# EAGLE design ATX_PSU_rev0.1 (EAGLE 9.1.1)
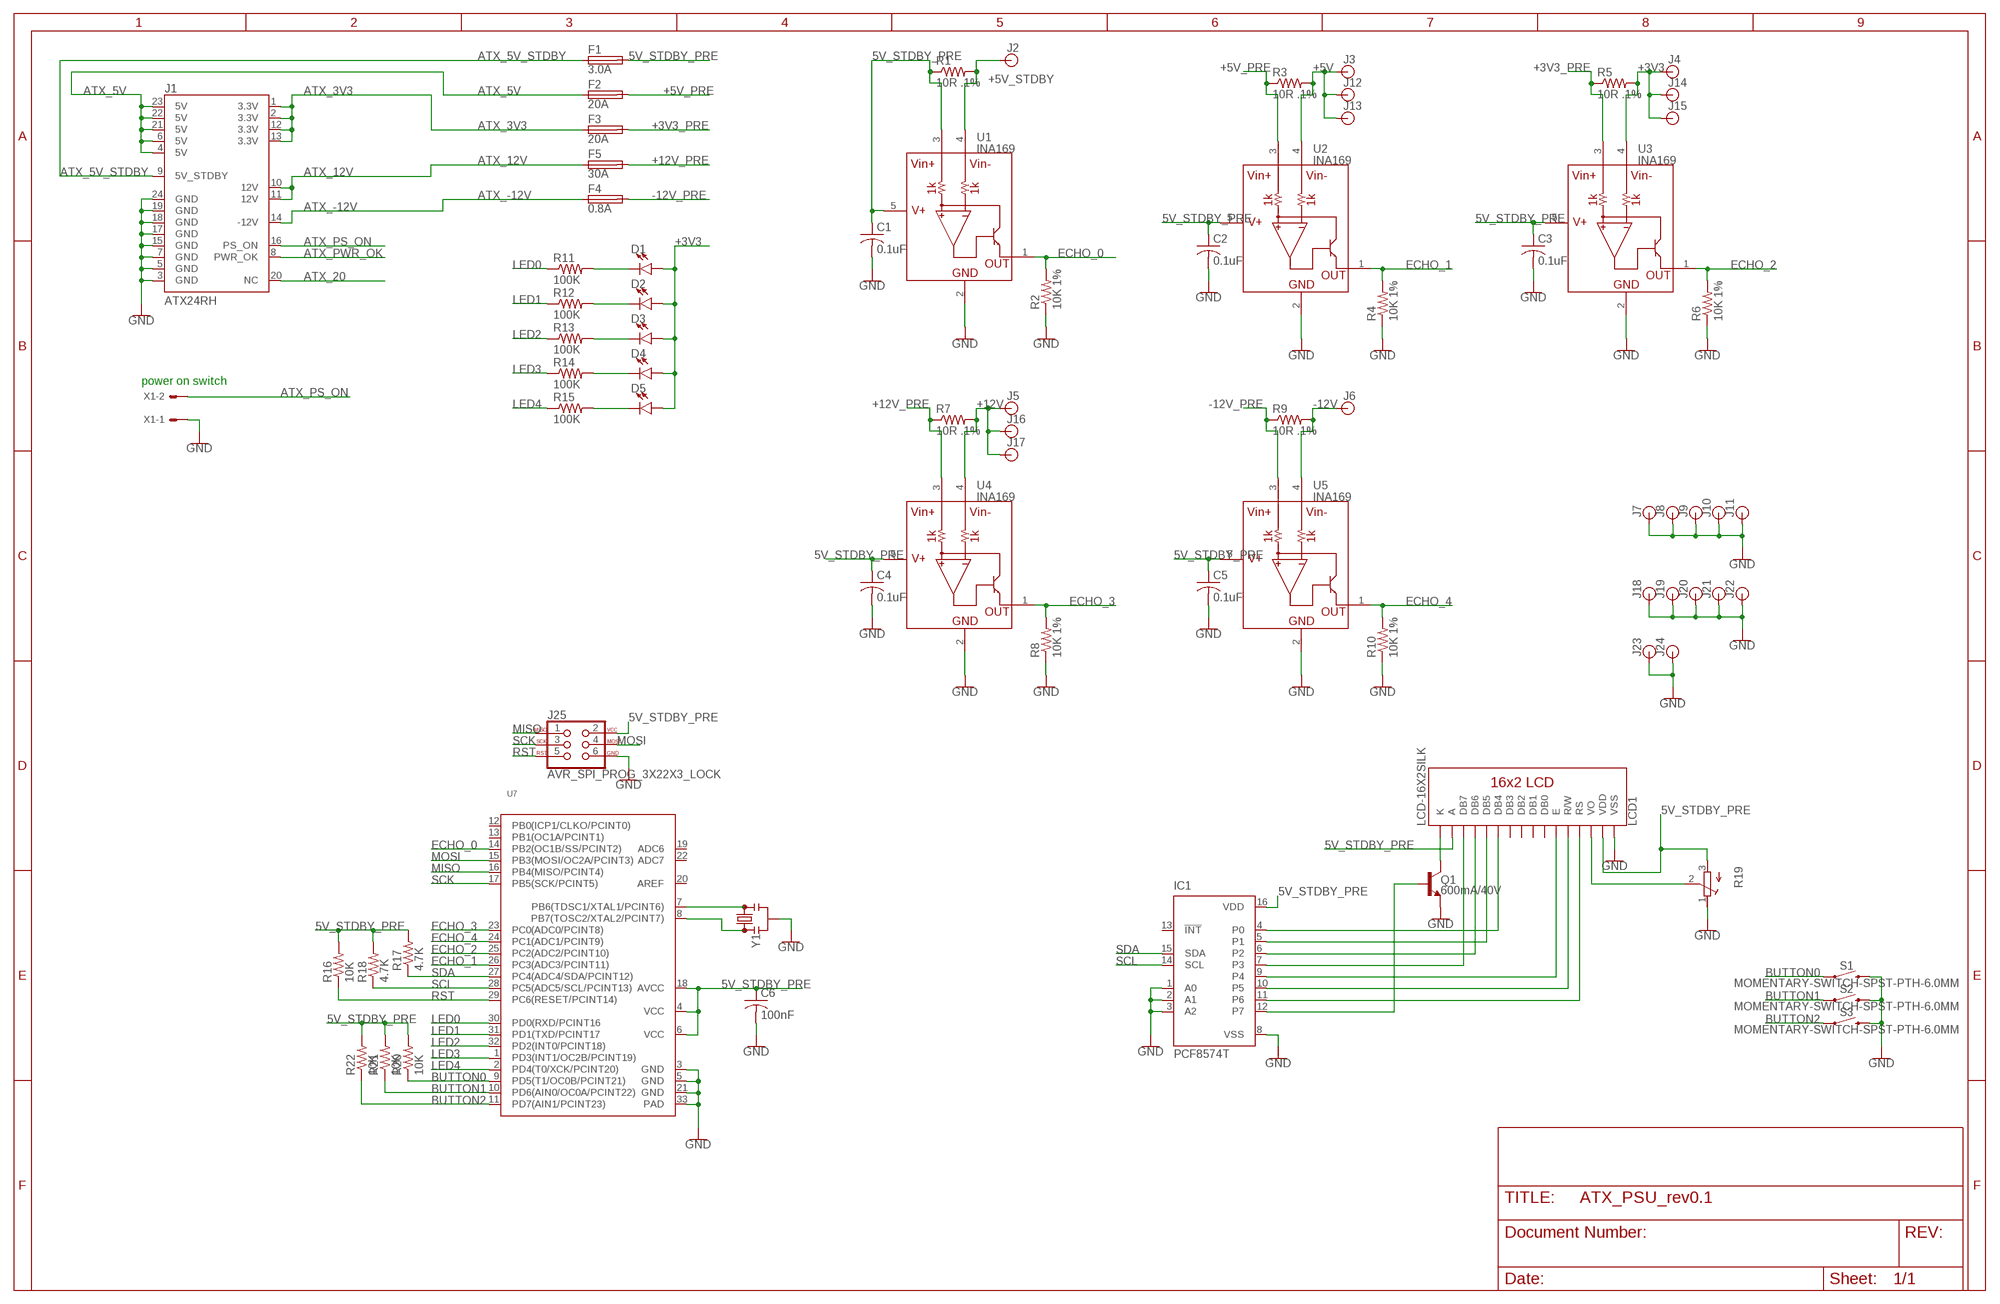
[diagram p0: schematic, sheet 1]

## Parts
C1  0.1uF  C-USC1206  [C1206]
C2  0.1uF  C-USC1206  [C1206]
C3  0.1uF  C-USC1206  [C1206]
C4  0.1uF  C-USC1206  [C1206]
C5  0.1uF  C-USC1206  [C1206]
C6  100nF  C-USC1206  [C1206]
D1  LED-FKIT-1206  [FKIT-LED-1206]
D2  LED-FKIT-1206  [FKIT-LED-1206]
D3  LED-FKIT-1206  [FKIT-LED-1206]
D4  LED-FKIT-1206  [FKIT-LED-1206]
D5  LED-FKIT-1206  [FKIT-LED-1206]
F1  3.0A  FUSEBLANK_5X20MM  [FUSE_HOLDER_5X20MM]
F2  20A  FUSEBLANK_5X20MM  [FUSE_HOLDER_5X20MM]
F3  20A  FUSEBLANK_5X20MM  [FUSE_HOLDER_5X20MM]
F4  0.8A  FUSEBLANK_5X20MM  [FUSE_HOLDER_5X20MM]
F5  30A  FUSEBLANK_5X20MM  [FUSE_HOLDER_5X20MM]
IC1  PCF8574T  [SO16W]
J1  ATX24RH  [ATX24_RIGHT_ANGLE]
J2  BANANA_CONN  [BANANA_CONN]
J3  BANANA_CONN  [BANANA_CONN]
J4  BANANA_CONN  [BANANA_CONN]
J5  BANANA_CONN  [BANANA_CONN]
J6  BANANA_CONN  [BANANA_CONN]
J7  BANANA_CONN  [BANANA_CONN]
J8  BANANA_CONN  [BANANA_CONN]
J9  BANANA_CONN  [BANANA_CONN]
J10  BANANA_CONN  [BANANA_CONN]
J11  BANANA_CONN  [BANANA_CONN]
J12  BANANA_CONN  [BANANA_CONN]
J13  BANANA_CONN  [BANANA_CONN]
J14  BANANA_CONN  [BANANA_CONN]
J15  BANANA_CONN  [BANANA_CONN]
J16  BANANA_CONN  [BANANA_CONN]
J17  BANANA_CONN  [BANANA_CONN]
J18  BANANA_CONN  [BANANA_CONN]
J19  BANANA_CONN  [BANANA_CONN]
J20  BANANA_CONN  [BANANA_CONN]
J21  BANANA_CONN  [BANANA_CONN]
J22  BANANA_CONN  [BANANA_CONN]
J23  BANANA_CONN  [BANANA_CONN]
J24  BANANA_CONN  [BANANA_CONN]
J25  AVR_SPI_PROG_3X22X3_LOCK  [2X3_LOCK]
LCD1  LCD-16X2SILK  [LCD-16X2]
Q1  600mA/40V  TRANS_NPN-MMBT2222AL  [SOT23-3]
R1  10R .1%  R-US_R1206  [R1206]
R2  10K 1%  R-US_R1206  [R1206]
R3  10R .1%  R-US_R1206  [R1206]
R4  10K 1%  R-US_R1206  [R1206]
R5  10R .1%  R-US_R1206  [R1206]
R6  10K 1%  R-US_R1206  [R1206]
R7  10R .1%  R-US_R1206  [R1206]
R8  10K 1%  R-US_R1206  [R1206]
R9  10R .1%  R-US_R1206  [R1206]
R10  10K 1%  R-US_R1206  [R1206]
R11  100K  R-US_R1206  [R1206]
R12  100K  R-US_R1206  [R1206]
R13  100K  R-US_R1206  [R1206]
R14  100K  R-US_R1206  [R1206]
R15  100K  R-US_R1206  [R1206]
R16  10K  R-US_R1206  [R1206]
R17  4.7K  R-US_R1206  [R1206]
R18  4.7K  R-US_R1206  [R1206]
R19  R-TRIMM3314G  [RTRIM3314G]
R20  10K  R-US_R1206  [R1206]
R21  10K  R-US_R1206  [R1206]
R22  10K  R-US_R1206  [R1206]
S1  MOMENTARY-SWITCH-SPST-PTH-6.0MM  [TACTILE_SWITCH_PTH_6.0MM]
S2  MOMENTARY-SWITCH-SPST-PTH-6.0MM  [TACTILE_SWITCH_PTH_6.0MM]
S3  MOMENTARY-SWITCH-SPST-PTH-6.0MM  [TACTILE_SWITCH_PTH_6.0MM]
U1  INA169  [SOT23-5]
U2  INA169  [SOT23-5]
U3  INA169  [SOT23-5]
U4  INA169  [SOT23-5]
U5  INA169  [SOT23-5]
U7  MCU-ATMEGA168PA-MU(QFN32)  [QFN32G-0.5-5X5MM]
X1  KK-156-2  [KK-156-2]
Y1  RESONATORSMD-3.2X1.3  [RESONATOR-SMD-3.2X1.3]

## Nets
5V_STDBY_PRE: C1.1 C2.1 C3.1 C4.1 C5.1 C6.1 F1.2 IC1.16(VDD) J25.2 LCD1.2(VDD) LCD1.15(A) R1.1 R16.2 R17.2 R18.2 R19.3(A) R20.2 R21.2 R22.2 U1.3(VIN+) U1.5(V+) U2.5(V+) U3.5(V+) U4.5(V+) U5.5(V+) U7.4(VCC) U7.6(VCC) U7.18(AVCC)
+3V3: D1.A D2.A D3.A D4.A D5.A J4.P$1 J14.P$1 J15.P$1 R5.2 U3.4(VIN-)
+3V3_PRE: F3.2 R5.1 U3.3(VIN+)
+5V: J3.P$1 J12.P$1 J13.P$1 R3.2 U2.4(VIN-)
+5V_PRE: F2.2 R3.1 U2.3(VIN+)
+5V_STDBY: J2.P$1 R1.2 U1.4(VIN-)
+12V: J5.P$1 J16.P$1 J17.P$1 R7.2 U4.4(VIN-)
+12V_PRE: F5.2 R7.1 U4.3(VIN+)
-12V: J6.P$1 R9.2 U5.4(VIN-)
-12V_PRE: F4.2 R9.1 U5.3(VIN+)
ATX_3V3: F3.1 J1.1(3.3V) J1.2(3.3V) J1.12(3.3V) J1.13(3.3V)
ATX_5V: F2.1 J1.4(5V) J1.6(5V) J1.21(5V) J1.22(5V) J1.23(5V)
ATX_5V_STDBY: F1.1 J1.9(5V_STDBY)
ATX_12V: F5.1 J1.10(12V) J1.11(12V)
ATX_20: J1.20(NC)
ATX_-12V: F4.1 J1.14(-12V)
ATX_PS_ON: J1.16(PS_ON) X1.2
ATX_PWR_OK: J1.8(PWR_OK)
BUTTON0: R20.1 S1.1 U7.9(PD5(T1/OC0B/PCINT21))
BUTTON1: R21.1 S2.1 U7.10(PD6(AIN0/OC0A/PCINT22))
BUTTON2: R22.1 S3.1 U7.11(PD7(AIN1/PCINT23))
ECHO_0: R2.2 U1.1(OUT) U7.14(PB2(OC1B/SS/PCINT2))
ECHO_1: R4.2 U2.1(OUT) U7.26(PC3(ADC3/PCINT11))
ECHO_2: R6.2 U3.1(OUT) U7.25(PC2(ADC2/PCINT10))
ECHO_3: R8.2 U4.1(OUT) U7.23(PC0(ADC0/PCINT8))
ECHO_4: R10.2 U5.1(OUT) U7.24(PC1(ADC1/PCINT9))
GND: C1.2 C2.2 C3.2 C4.2 C5.2 C6.2 IC1.1(A0) IC1.2(A1) IC1.3(A2) IC1.8(VSS) J1.3(GND) J1.5(GND) J1.7(GND) J1.15(GND) J1.17(GND) J1.18(GND) J1.19(GND) J1.24(GND) J7.P$1 J8.P$1 J9.P$1 J10.P$1 J11.P$1 J18.P$1 J19.P$1 J20.P$1 J21.P$1 J22.P$1 J23.P$1 J24.P$1 J25.6 LCD1.1(VSS) Q1.2(E) R2.1 R4.1 R6.1 R8.1 R10.1 R19.1(E) S1.3 S2.3 S3.3 U1.2(GND) U2.2(GND) U3.2(GND) U4.2(GND) U5.2(GND) U7.3(GND) U7.5(GND) U7.21(GND) U7.33(PAD) X1.1 Y1.2
LED0: R11.1 U7.30(PD0(RXD/PCINT16)
LED1: R12.1 U7.31(PD1(TXD/PCINT17)
LED2: R13.1 U7.32(PD2(INT0/PCINT18))
LED3: R14.1 U7.1(PD3(INT1/OC2B/PCINT19))
LED4: R15.1 U7.2(PD4(T0/XCK/PCINT20))
MISO: J25.1 U7.16(PB4(MISO/PCINT4))
MOSI: J25.4 U7.15(PB3(MOSI/OC2A/PCINT3))
N$1: D1.C R11.2
N$2: D2.C R12.2
N$3: IC1.4(P0) LCD1.11(DB4)
N$4: D3.C R13.2
N$5: D4.C R14.2
N$6: D5.C R15.2
N$7: IC1.5(P1) LCD1.12(DB5)
N$8: U7.8(PB7(TOSC2/XTAL2/PCINT7)) Y1.1
N$9: IC1.6(P2) LCD1.13(DB6)
N$10: IC1.7(P3) LCD1.14(DB7)
N$11: U7.7(PB6(TDSC1/XTAL1/PCINT6)) Y1.3
N$12: IC1.9(P4) LCD1.6(E)
N$13: IC1.10(P5) LCD1.5(R/W)
N$14: IC1.11(P6) LCD1.4(RS)
N$15: IC1.12(P7) Q1.1(B)
N$16: LCD1.16(K) Q1.3(C)
N$18: LCD1.3(VO) R19.2(S)
RST: J25.5 R16.1 U7.29(PC6(RESET/PCINT14))
SCK: J25.3 U7.17(PB5(SCK/PCINT5))
SCL: IC1.14(SCL) R18.1 U7.28(PC5(ADC5/SCL/PCINT13))
SDA: IC1.15(SDA) R17.1 U7.27(PC4(ADC4/SDA/PCINT12))
Unconnected: IC1.13(!INT) LCD1.7(DB0) LCD1.8(DB1) LCD1.9(DB2) LCD1.10(DB3) U7.12(PB0(ICP1/CLKO/PCINT0)) U7.13(PB1(OC1A/PCINT1)) U7.19(ADC6) U7.20(AREF) U7.22(ADC7)

## Notes on the sheet
- power on switch

## Library data of the parts
C1-C6 = resistor:C-US: CAPACITOR, American symbol
D1-D5 = SparkFun-LED:LED: LED (Generic) Standard schematic elements and footprints for 5mm, 3mm, 1206, and 0603 sized LEDs. Generic LEDs with no color specified.
F1-F5 = fuse:FUSE: Fuse; OC_FARNELL: unknown; OC_NEWARK: unknown
IC1 = micro-philips:PCF8574: I2C-Bus Remote 8-bit I/O expander http://www.semiconductors.philips.com/acrobat_download/datasheets/PCF8574_4.pdf; MPN: PCF8574T/3,512; OC_FARNELL: 1201255; OC_NEWARK: 70R6870
J1 = SparkFun-Connectors:ATX24: ATX24 Pin Power Supply Connector - Right Angle PTH Mount This is a good connector for connecting a computer power supply to a PCB. It's massive, but provides many amps of power at 5V and 12V. SparkFun Products: SparkFun Benchtop Power Board Kit <https://www.sparkfun.com/products/12867> SparkFun Power Driver Shield Kit <https://www.sparkfun.com/products/10618>; PROD_ID: CONN-09674; SF_ID: PRT-09498
J2-J24 = SparkFun-Connectors:BANANA_CONN: Through-hole Banana Jack Basic PTH connection for banana jack plugs SparkFun Products: Multimeter Kit <https://www.sparkfun.com/products/retired/10956> Banana to Alligator Cable <https://www.sparkfun.com/products/retired/509> Banana to Alligator Coax Cable <https://www.sparkfun.com/products/retired/508> Banana to Banana Cable <https://www.sparkfun.com/products/retired/507> Banana to IC Hook Cables <https://www.sparkfun.com/products/retired/506>
J25 = SparkFun-Connectors:AVR_SPI_PROG_3X2: AVR ISP 6 Pin This is the reduced ISP connector for AVR programming. Common on Arduino. This footprint will take up less PCB space and can be used with a 10-pin to 6-pin adapter such as SKU: BOB-08508 **Special note about "TEST_POINT" package. The stop mask is on the top side, so if you want your programming test points to be on the bottom of your board, make sure to place this package on the bottom side of the board. This also ensure that the orientation to program from the bottom side will be correct. SparkFun Products: SparkFun ISP Pogo Adapter <https://www.sparkfun.com/products/11591> - NS Tiny AVR Programmer <https://www.sparkfun.com/products/11801> -PTH
LCD1 = SparkFun-Displays:LCD-16X2: Standard text-only 16x2 parallel input LCD Basic 16 character by 2 line display. Typically utilizes the extremely common HD44780 parallel interface chipset SparkFun Products: Basic 16x2 Green <https://www.sparkfun.com/products/255> Basic 8x2 Green <https://www.sparkfun.com/products/11122>; SF_ID: LCD-00255
Q1 = SparkFun-DiscreteSemi:TRANS_NPN: NPN transistor Current controlled devices typically used to amplify current or used as a switch. BC547 - COM-08928 <http://www.sparkfun.com/products/8928> (TO-92 45V 100mA) (1.Collector 2.Base 3.Emitter) 2N3904 - COM-00521 <http://www.sparkfun.com/products/521> (TO-92 40V 200mA) (1.Emitter 2.Base 3.Collector) P2N2222A - COM-12852 <http://www.sparkfun.com/products/12852> (TO-92 40V 600mA) (1.Collector 2.Base 3.Emitter); PROD_ID: TRANS-08049
R1-R18 R20-R22 = resistor:R-US_: RESISTOR, American symbol
R19 = resistor:R-TRIMM: Trimm resistor
S1-S3 = SparkFun-Switches:MOMENTARY-SWITCH-SPST: Momentary Switch (Pushbutton) - SPST Normally-open (NO) SPST momentary switches (buttons, pushbuttons). Variants PTH-12MM - 12mm square, through-hole Momentary Pushbutton Switch - 12mm Square <https://www.sparkfun.com/products/9190> (COM-09190) PTH-6.0MM, PTH-6.0MM-KIT - 6.0mm square, through-hole Mini Pushbutton Switch <https://www.sparkfun.com/products/97> (COM-00097) KIT package intended for soldering kit's - only one side of pads' copper is exposed. PTH-RIGHT-ANGLE-KIT - Right-angle, through-hole Right Angle Tactile Button <https://www.sparkfun.com/products/10791> - Used on SparkFun BigTime Watch Kit <https://www.sparkfun.com/products/11734> SMD-12MM - 12mm square, surface-mount Tactile Button - SMD (12mm) <https://www.sparkfun.com/products/12993> (COM-12993) Used on SparkFun PicoBoard <https://www.sparkfun.com/products/11888> SMD-4.5MM - 4.5mm Square Trackball Switch Used on SparkFun Blackberry Trackballer Breakout <https://www.sparkfun.com/products/13169> SMD-4.6MMX2.8MM - 4.60mm x 2.80mm, surface mount Used on SparkFun SAMD21 Mini Breakout <https://www.sparkfun.com/products/13664> SMD-5.2MM, SMD-5.2-REDUNDANT - 5.2mm square, surface-mount Mini Pushbutton Switch - SMD <https://www.sparkfun.com/products/8720> (COM-08720) Used on Arduino Pro Mini <https://www.sparkfun.com/products/11114> REDUNDANT package connects both switch circuits together SMD-6.0X3.5MM - 6.0 x 3.5mm, surface mount Momentary Reset Switch SMD <https://www.sparkfun.com/products/8229> (COM-08229) SMD-6.2MM-TALL - 6.2mm square, surface mount Tactile Button - SMD (6mm) <https://www.sparkfun.com/products/12992> Used on SparkFun Digital Sandbox <https://www.sparkfun.com/products/12651> SMD-RIGHT-ANGLE - Right-angle, surface mount Used on SparkFun Block for Intel® Edison - Arduino <https://www.sparkfun.com/products/13036>; PROD_ID: SWCH-08441; SF_SKU: COM-00097
U1-U5 = SparkFun-IC-Special-Function:INA169: Current Output Current Shunt Monitor 0.5%, SOT23-5 Datasheet <http://cdn.sparkfun.com/datasheets/Sensors/Current/ina169.pdf> SparkFun Products SparkFun Current Sensor Breakout - INA169 <https://www.sparkfun.com/products/12040> (SEN-12040); PROD_ID: IC-11776
U7 = Seeed-IC:MCU-ATMEGA168PA-MU(QFN32): 310010072
X1 = con-molex:KK-156-2: KK 156 HEADER Source: http://www.molex.com/pdm_docs/sd/026604100_sd.pdf; MF: MOLEX; OC_FARNELL: unknown; OC_NEWARK: unknown
Y1 = SparkFun-Clocks:RESONATOR: Resonators (Generic) Ceramic resonators are clock-generating components, often used to control timing in microcontrollers. They usually have 3 pins: two pins for oscillation, and one pin for ground. Compared to crystals, resonators have worse tolerance, but are usually much cheaper. Plus, they have built-in load capacitors! These devices are used on boards like the Arduino Pro 8MHz <https://www.sparkfun.com/products/11114> and Arduino Pro 16MHz <https://www.sparkfun.com/products/11113>.

## Board
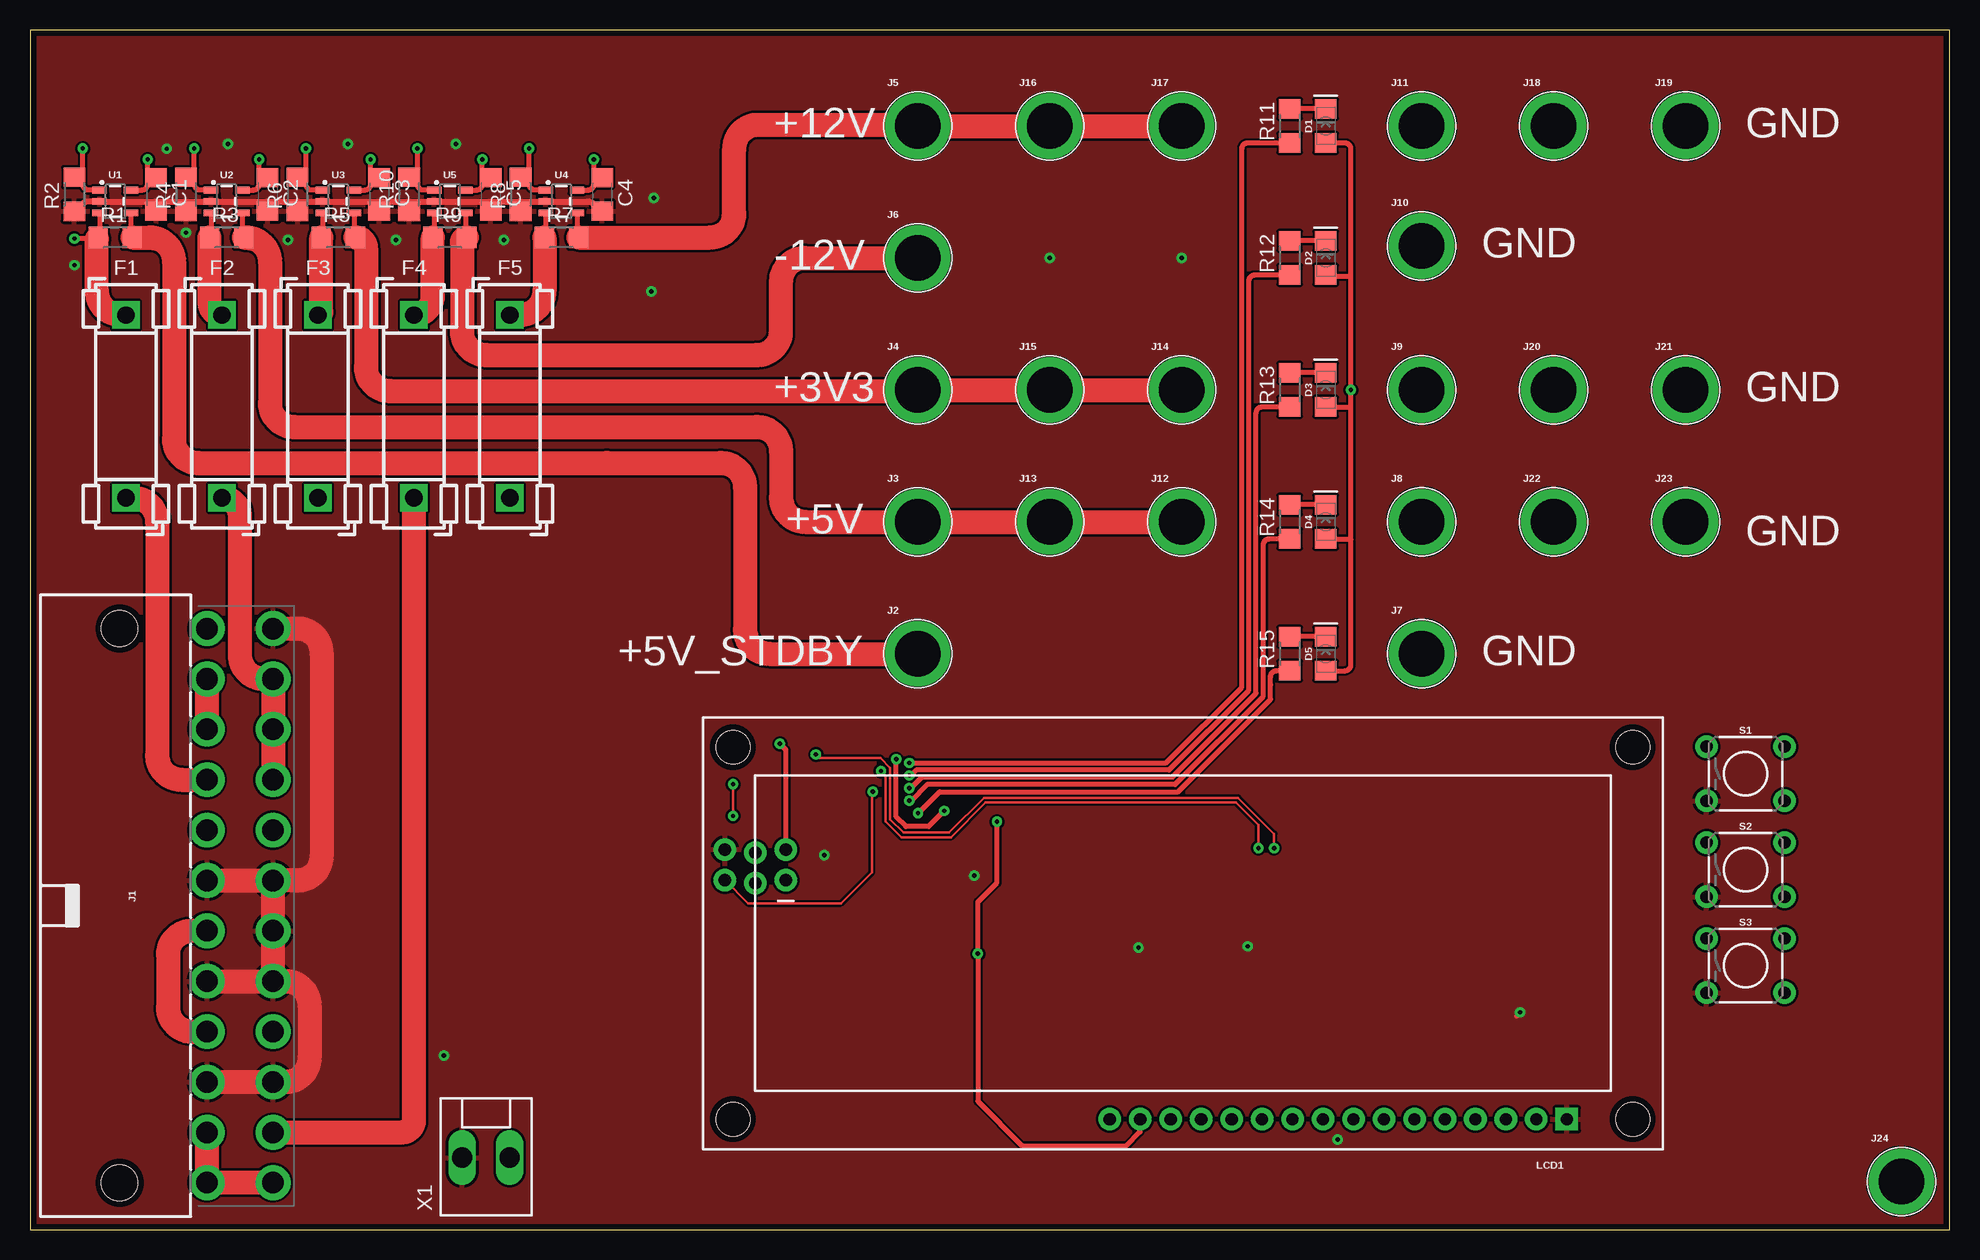
[diagram p1: board, top side]
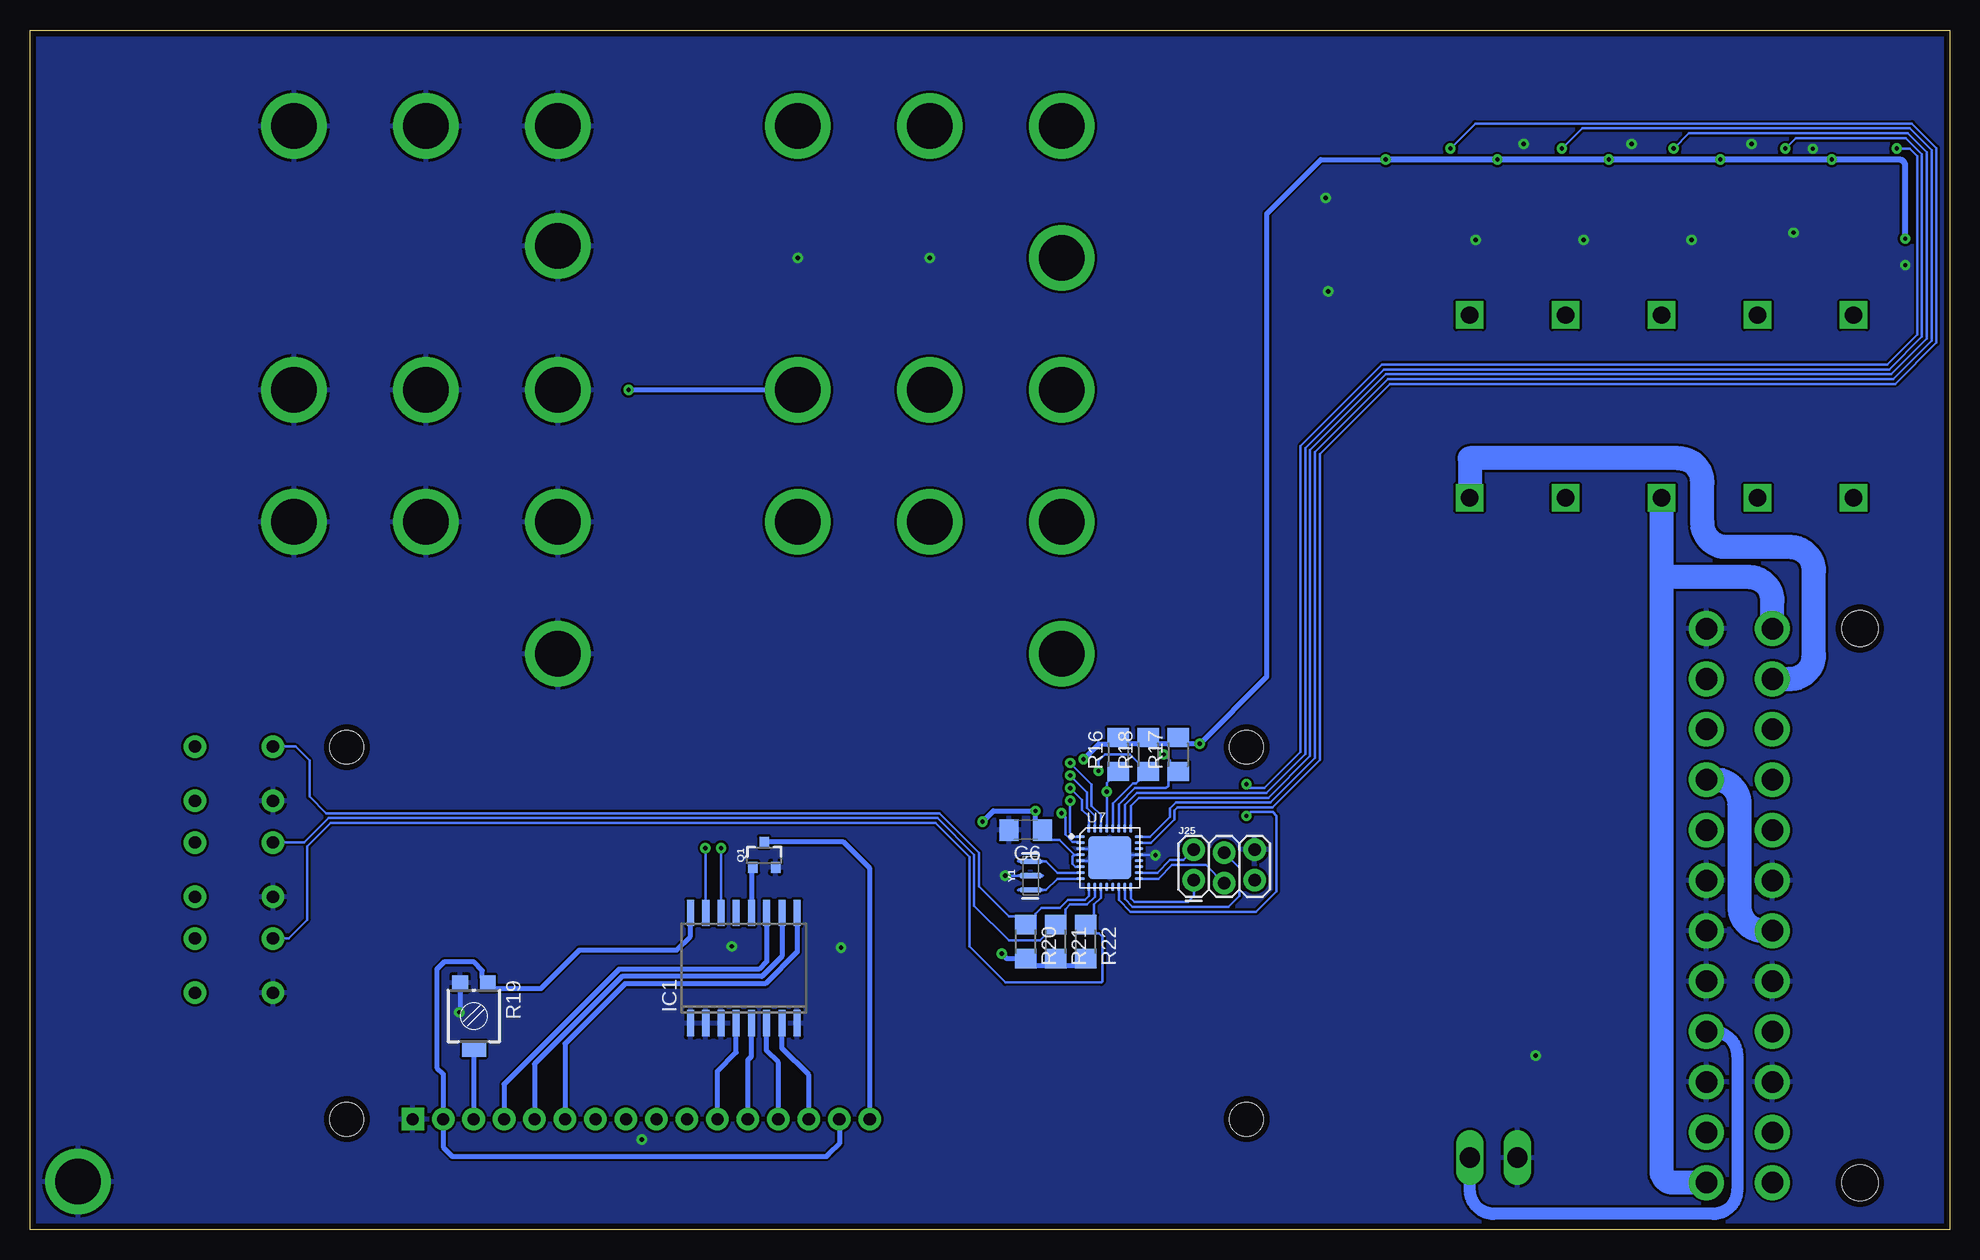
[diagram p2: board, bottom side, seen from below]

Size 160 x 100 mm. Coordinates in mm from the lower left corner, seen from the top.
Outline: 0,0 160,0 160,100 0,100 0,0
Copper layers (1*16): Top 0.035mm / dielectric 1.5mm / Bottom 0.035mm
Design rules "Class_5_0,20mm": minimum track width 0.2mm, minimum drill 0.3mm, track to track 0.2mm, track to pad 0.2mm, pad to pad 0.2mm, via to via 0.2mm, smd to smd 0.2mm, copper to edge 0.5mm, drill to drill 0.2mm, minimum pad ring 0.3mm, minimum via ring 0.25mm, stop-mask expansion 0.1mm, vias tented up to drill 0.6mm, thermal gap 0.25mm

### Footprints (pad centres in the part's own frame; a part is rotated, then mirrored left to right if it is on the bottom)
C1206 = smd 1.6 x 1.8: 1 -1.4,0; 2 1.4,0
FKIT-LED-1206 = smd 1.6 x 1.803: A -1.422,0; C 1.422,0
FUSE_HOLDER_5X20MM = drill 1.422 pad 2.286 square: 1 0,0; 2 15.24,0
SO16W = smd 0.6 x 2.2: 1 -4.445,-4.6; 2 -3.175,-4.6; 3 -1.905,-4.6; 4 -0.635,-4.6; 5 0.635,-4.6; 6 1.905,-4.6; 7 3.175,-4.6; 8 4.445,-4.6; 9 4.445,4.6; 10 3.175,4.6; 11 1.905,4.6; 12 0.635,4.6; 13 -0.635,4.6; 14 -1.905,4.6; 15 -3.175,4.6; 16 -4.445,4.6
ATX24_RIGHT_ANGLE = drill 1.8 pad 2.9: 1 23.1,4.76; 2 18.9,4.76; 3 14.7,4.76; 4 10.5,4.76; 5 6.3,4.76; 6 2.1,4.76; 7 -2.1,4.76; 8 -6.3,4.76; 9 -10.5,4.76; 10 -14.7,4.76; 11 -18.9,4.76; 12 -23.1,4.76; 13 23.1,10.26; 14 18.9,10.26; 15 14.7,10.26; 16 10.5,10.26; 17 6.3,10.26; 18 2.1,10.26; 19 -2.1,10.26; 20 -6.3,10.26; 21 -10.5,10.26; 22 -14.7,10.26; 23 -18.9,10.26; 24 -23.1,10.26 | hole 3: -23.1,-2.54; 23.1,-2.54
BANANA_CONN = drill 3.81 pad 5.461: P$1 0,0
2X3_LOCK = drill 1.016 pad 1.88: 1 0,0.127; 2 0,2.667; 3 2.54,-0.127; 4 2.54,2.413; 5 5.08,0.127; 6 5.08,2.667
LCD-16X2 = drill 1.016 pad 1.88 square: 1 -32,15.5 | drill 1.016 pad 1.88: 2 -29.46,15.5; 3 -26.92,15.5; 4 -24.38,15.5; 5 -21.84,15.5; 6 -19.3,15.5; 7 -16.76,15.5; 8 -14.22,15.5; 9 -11.68,15.5; 10 -9.14,15.5; 11 -6.6,15.5; 12 -4.06,15.5; 13 -1.52,15.5; 14 1.02,15.5; 15 3.56,15.5; 16 6.1,15.5 | hole 2.8: -37.5,15.5; -37.5,-15.5; 37.5,15.5; 37.5,-15.5
SOT23-3 = smd 0.8 x 0.9: 1 -0.95,-1; 2 0.95,-1; 3 0,1.1
R1206 = smd 1.6 x 1.803: 1 -1.422,0; 2 1.422,0
RTRIM3314G = smd 1.3 x 1.3: 1 1.15,-2.75; 3 -1.15,-2.75 | smd 2 x 1.3: 2 0,2.75
TACTILE_SWITCH_PTH_6.0MM = drill 1.016 pad 1.88: 1 -3.251,2.261; 2 3.251,2.261; 3 -3.251,-2.261; 4 3.251,-2.261
SOT23-5 = smd 0.55 x 1.2: 1 -0.95,-1.3; 2 0,-1.3; 3 0.95,-1.3; 4 0.95,1.3; 5 -0.95,1.3
QFN32G-0.5-5X5MM = smd 0.7 x 0.25: 1 -2.45,1.75; 2 -2.45,1.25; 3 -2.45,0.75; 4 -2.45,0.25; 5 -2.45,-0.25; 6 -2.45,-0.75; 7 -2.45,-1.25; 8 -2.45,-1.75; 17 2.45,-1.75; 18 2.45,-1.25; 19 2.45,-0.75; 20 2.45,-0.25; 21 2.45,0.25; 22 2.45,0.75; 23 2.45,1.25; 24 2.45,1.75 | smd 0.25 x 0.7: 9 -1.75,-2.45; 10 -1.25,-2.45; 11 -0.75,-2.45; 12 -0.25,-2.45; 13 0.25,-2.45; 14 0.75,-2.45; 15 1.25,-2.45; 16 1.75,-2.45; 25 1.75,2.45; 26 1.25,2.45; 27 0.75,2.45; 28 0.25,2.45; 29 -0.25,2.45; 30 -0.75,2.45; 31 -1.25,2.45; 32 -1.75,2.45 | smd 3.6 x 3.6: 33 0,0
KK-156-2 = drill 1.7 pad 2.184 long: 1 -1.98,0; 2 1.98,0
RESONATOR-SMD-3.2X1.3 = smd 0.45 x 1.905: 1 -1.2,0; 2 0,0; 3 1.2,0

### Placement (x,y rotation side)
C1  10.5,86.3 270 top
C2  19.8,86.3 270 top
C3  29.1,86.3 270 top
C4  47.7,86.3 270 top
C5  38.4,86.3 270 top
C6  77,33.3 180 bottom
D1  108,92 90 top
D2  108,81 90 top
D3  108,70 90 top
D4  108,59 90 top
D5  108,48 90 top
F1  8,61 90 top
F2  16,61 90 top
F3  24,61 90 top
F4  32,61 90 top
F5  40,61 90 top
IC1  100.5,21.8 0 bottom
J1  10,27 270 top
J2  74,48 0 top
J3  74,59 0 top
J4  74,70 0 top
J5  74,92 0 top
J6  74,81 0 top
J7  116,48 0 top
J8  116,59 0 top
J9  116,70 0 top
J10  116,82 0 top
J11  116,92 0 top
J12  96,59 0 top
J13  85,59 0 top
J14  96,70 0 top
J15  85,70 0 top
J16  85,92 0 top
J17  96,92 0 top
J18  127,92 0 top
J19  138,92 0 top
J20  127,70 0 top
J21  138,70 0 top
J22  127,59 0 top
J23  138,59 0 top
J24  156,4 0 top
J25  63,29 0 bottom
LCD1  96.1,24.7 180 top
Q1  98.8,31.2 0 bottom
R1  7.1,82.7 0 top
R2  3.7,86.3 90 top
R3  16.4,82.7 0 top
R4  13,86.3 90 top
R5  25.7,82.7 0 top
R6  22.3,86.3 90 top
R7  44.3,82.7 0 top
R8  40.9,86.3 90 top
R9  35,82.7 0 top
R10  31.6,86.3 90 top
R11  105,92 90 top
R12  105,81 90 top
R13  105,70 90 top
R14  105,59 90 top
R15  105,48 90 top
R16  69.3,39.6 90 bottom
R17  64.3,39.6 90 bottom
R18  66.8,39.6 90 bottom
R19  123,17.8 180 bottom
R20  77,24 270 bottom
R21  74.5,24 270 bottom
R22  72,24 270 bottom
S1  143,38 0 top
S2  143,30 0 top
S3  143,22 0 top
U1  7.1,85.7 270 top
U2  16.4,85.7 270 top
U3  25.7,85.7 270 top
U4  44.3,85.7 270 top
U5  35,85.7 270 top
U7  70,31 0 bottom
X1  38,6 0 top
Y1  76.6,29.5 90 bottom

### Tracks (layer width: path | path; a pad name or v marks a point on that pad's centre or on a via)
5V_STDBY_PRE  (via drill 0.35)
  Top 0.4: 9.3,86.65 arc90 9.8,87.15 | 9.8,87.15 9.8,87.5 | 9.8,87.5 arc-90 10,87.7 C1.1 10.3,87.7 arc-90 9.8,88.2 | U2.5 18.6,86.65 arc90 19.1,87.15 19.1,87.4 arc-90 19.4,87.7 C2.1 19.6,87.7 arc-90 19.1,88.2 v19.1,89.2 | C5.1 38.2,87.7 arc-90 37.7,88.2 | 37.7,88.2 v37.7,89.2 | C4.1 47.5,87.7 arc-90 47,88.2 | 47,88.2 v47,89.2 | C3.1 28.9,87.7 arc-90 28.4,88.2 | 28.4,88.2 v28.4,89.2 | 9.8,88.2 v9.8,89.2 | v3.7,82.6 5.58,82.6 arc90 R1.1 arc90 5.8,82.82 U1.3 | U5.5 37.2,86.65 arc90 37.7,87.15 37.7,88.2 | U4.5 46.5,86.65 arc90 47,87.15 47,88.2 | U3.5 27.9,86.65 arc90 28.4,87.15 28.4,88.2 | U1.5 9.3,86.65 | 9.3,86.65 arc90 9.8,87.15 | 9.8,87.5 9.8,88.2 | v76.2,34.9 74.9,33.6 73,33.6 72.2,34.4 v72.2,39.2 | v62.5,40.5 63,40 J25.2 | LCD1.15 92.54,8.14 91.4,7 82.7,7 79,10.7 v79,23 79,27.3 80.6,28.9 v80.6,34
  Top 2: F1.2 7.58,76.24 arc-90 5.58,78.24 5.58,82.6
  Bottom 0.2: U7.4 72.95,31.25 | C6.1 75.6,33 75.1,32.5 74.2,32.5 72.95,31.25 | U7.6 72.85,30.25 73.1,30.5 73.1,31.1 72.95,31.25 | U7.18 66.02,29.75 64.97,30.8 63.87,30.8 J25.2
  Bottom 0.4: C6.1 76.2,33.9 v76.2,34.9 79.7,34.9 v80.6,34 | v72.2,39.2 70.9,40.5 69.82,40.5 R16.2 68.78,40.5 67.32,40.5 R18.2 66.28,40.5 64.82,40.5 R17.2 64.3,41 63.8,40.5 v62.5,40.5 56.9,46.1 56.9,84.7 52.4,89.2 v47,89.2 | LCD1.15 92.54,7.16 93.4,6.3 93.6,6.1 124.8,6.1 125.56,6.86 LCD1.2 125.56,12.96 126.1,13.5 126.1,21.7 125.5,22.3 123,22.3 122.3,21.6 122.3,21 R19.3 arc-90 121.4,20.1 117.4,20.1 114.2,23.3 106.1,23.3 104.94,24.45 IC1.16 | R22.2 72.58,22 74.5,22 | 74.5,22 76.6,22 77,22.4 R20.2 78.58,22.58 v79,23 | R21.2 74.5,22
  Bottom 0.5: v3.7,82.6 3.7,88.7 arc-90 4.2,89.2 v9.8,89.2 v19.1,89.2 v28.4,89.2 v37.7,89.2 v47,89.2
+3V3  (via drill 0.35)
  Top 0.4: U3.4 27,82.82 arc90 R5.2 | D5.A 109.6,46.58 arc90 110.1,47.08 110.1,57.5 | D1.A 109.6,90.58 arc-90 110.1,90.08 110.1,79.5 | 110.1,57.5 110.1,68.6 | 110.1,68.6 v110.1,70 110.1,79.4 | 110.1,79.4 110.1,79.5 | 110.1,79.4 | D2.A arc90 108.08,79.5 110.1,79.5 | D3.A 110.08,68.58 arc90 110.1,68.6 | D4.A 110.02,57.58 arc-90 110.1,57.5
  Top 2: R5.2 arc-90 28,81.82 28,71.9 arc90 30,69.9 73.9,69.9 arc90 J4.P$1 J15.P$1 J14.P$1
  Bottom 0.4: J14.P$1 v110.1,70
+3V3_PRE
  Top 0.4: U3.3 24.4,82.82 arc-90 R5.1
  Top 2: F3.2 arc90 24.28,76.52 R5.1
+5V
  Top 0.4: U2.4 17.7,82.82 arc90 R3.2
  Top 2: R3.2 18,82.7 arc-90 20,80.7 20,68.9 arc90 22,66.9 60.6,66.9 arc-90 62.6,64.9 62.6,61 arc90 64.6,59 J3.P$1 J13.P$1 J12.P$1
+5V_PRE
  Top 0.4: U2.3 15.1,82.82 arc-90 R3.1
  Top 2: F2.2 arc-90 14.98,77.26 R3.1
+5V_STDBY
  Top 0.4: U1.4 8.4,82.82 arc90 R1.2
  Top 2: R1.2 10,82.7 arc-90 12,80.7 12,65.9 arc90 14,63.9 48.1,63.9 | 48.1,63.9 | 48.1,63.9 57.6,63.9 arc-90 59.6,61.9 59.6,50 arc90 61.6,48 J2.P$1
+12V
  Top 0.4: U4.4 45.6,82.82 arc90 R7.2
  Top 2: R7.2 56.7,82.7 arc90 58.7,84.7 58.7,90.1 arc-90 60.7,92.1 73.9,92.1 arc-90 J5.P$1 J16.P$1 J17.P$1
+12V_PRE
  Top 0.4: U4.3 43,82.82 arc-90 R7.1
  Top 2: R7.1 42.88,78.24 arc-90 40.88,76.24 F5.2
-12V
  Top 0.4: U5.4 36.3,82.82 arc90 R9.2
  Top 2: R9.2 arc90 36,82.28 36,74.9 arc90 38,72.9 60.6,72.9 arc90 62.6,74.9 62.6,79 arc-90 64.6,81 J6.P$1
-12V_PRE
  Top 0.4: U5.3 33.7,82.82 arc-90 R9.1
  Top 2: F4.2 arc90 33.58,77.82 R9.1
ATX_3V3
  Top 2: J1.2 J1.1 J1.13
  Bottom 2: J1.12 14.76,52.4 arc-90 16.76,54.4 23,54.4 arc90 24,55.4 F3.1 24,4.9 arc-90 23,3.9 J1.13
ATX_5V
  Top 2: J1.6 13.5,24.9 arc90 11.5,22.9 11.5,18.5 arc90 13.5,16.5 J1.4 | J1.21 J1.22 J1.23 19.5,45.9 arc-90 17.5,47.9 17.5,59.5 arc90 F2.1
  Bottom 2: J1.6 15.5,24.9 arc90 17.5,26.9 17.5,35.5 arc-90 19.5,37.5 J1.21
ATX_5V_STDBY
  Top 2: F1.1 8.6,61 arc-90 10.6,59 10.6,39.5 arc90 12.6,37.5 J1.9
ATX_12V
  Top 2: J1.10 J1.11
  Bottom 2: J1.11 13.3,45.9 arc-90 11.3,47.9 11.3,54.9 arc-90 13.3,56.9 18.6,56.9 arc90 20.6,58.9 20.6,62.3 arc-90 22.6,64.3 40,64.3 F5.1
ATX_-12V
  Top 2: J1.14 31,8.1 arc90 32,9.1 F4.1
ATX_PS_ON
  Bottom 1: J1.16 19.7,16.5 arc90 17.7,14.5 17.7,3.3 arc90 19.7,1.3 37.98,1.3 arc90 39.98,3.3 X1.2
BUTTON0
  Bottom 0.2: U7.9 71.75,27.82 72.07,27.5 73.47,27.5 74.17,26.8 75.7,26.8 76.2,26.3 76.2,25.7 76.48,25.42 R20.1 77.68,26.1 78.4,26.1 80.9,28.6 80.9,31.4 84.2,34.7 135.3,34.7 136.7,36.1 136.7,39.1 137.86,40.26 S1.1
BUTTON1
  Bottom 0.2: U7.10 71.25,27.75 71.9,27.1 73.3,27.1 73.7,26.7 73.7,25.8 74.08,25.42 R21.1 75.82,24.1 78.4,24.1 81.3,27 81.3,31.23 84.37,34.3 135.1,34.3 137.14,32.26 S2.1
BUTTON2
  Bottom 0.2: U7.11 70.75,27.65 71.3,27.1 71.3,25.4 71.98,25.4 R22.1 71.28,24.7 70.9,24.7 70.6,24.4 70.6,20.7 70.7,20.6 78.7,20.6 81.7,23.6 81.7,31.07 84.53,33.9 134.93,33.9 136.9,31.93 136.9,25.8 138.44,24.26 S3.1
ECHO_0  (via drill 0.35)
  Top 0.2: v58.6,37.12 v58.6,34.48
  Top 0.4: U1.1 4.9,86.65 arc-90 4.4,87.15 4.4,87.4 arc90 4.08,87.72 R2.2 3.9,87.72 arc90 4.4,88.22 v4.4,90.12
  Bottom 0.2: v4.4,90.12 3.33,90.12 2.7,89.5 2.7,74.6 5.2,72.1 47.3,72.1 54.1,65.3 54.1,39.8 57.1,36.8 58.6,36.8 v58.6,37.12 | v58.6,34.48 58.27,34.8 56.4,34.8 56.1,34.5 56.1,28.2 57.8,26.5 68.27,26.5 69.25,27.48 U7.14
ECHO_1  (via drill 0.35)
  Top 0.4: U2.1 14.2,86.65 arc-90 13.7,87.15 13.7,87.4 arc90 13.38,87.72 R4.2 13.2,87.72 arc90 13.7,88.22 v13.7,90.12
  Bottom 0.2: v13.7,90.12 12.82,91 3.63,91 2.3,89.67 2.3,74.43 5.03,71.7 47.13,71.7 53.7,65.13 53.7,39.63 56.93,36.4 67.73,36.4 68.75,35.38 U7.26
ECHO_2  (via drill 0.35)
  Top 0.4: R6.2 22.5,87.72 arc90 23,88.22 | 23,88.22 v23,90.12 | U3.1 23.5,86.65 arc-90 23,87.15 23,88.22
  Bottom 0.2: v23,90.12 21.73,91.4 3.47,91.4 1.9,89.83 1.9,74.27 4.87,71.3 46.97,71.3 53.3,64.97 53.3,39.47 56.77,36 67.57,36 68.25,35.32 U7.25
ECHO_3  (via drill 0.35)
  Top 0.4: R8.2 41.1,87.72 arc90 41.6,88.22 | 41.6,88.22 v41.6,90.12 | U4.1 42.1,86.65 arc-90 41.6,87.15 41.6,88.22
  Bottom 0.2: v41.6,90.12 39.52,92.2 3.14,92.2 1.1,90.16 1.1,73.94 4.54,70.5 46.64,70.5 52.5,64.64 52.5,39.14 56.44,35.2 58.4,35.2 | 58.4,35.2 | 58.4,35.2 64.33,35.2 64.6,34.93 64.6,34.2 66.55,32.25 U7.23
ECHO_4  (via drill 0.35)
  Top 0.4: R10.2 31.8,87.72 arc90 32.3,88.22 | 32.3,88.22 v32.3,90.12 | U5.1 32.8,86.65 arc-90 32.3,87.15 32.3,88.22
  Bottom 0.2: v32.3,90.12 30.62,91.8 3.3,91.8 1.5,90 1.5,88.9 1.5,74.1 4.7,70.9 46.8,70.9 52.9,64.8 52.9,51.3 52.9,39.3 56.6,35.6 59.7,35.6 | 59.7,35.6 | 59.7,35.6 64.5,35.6 65,35.1 65,34.4 66.65,32.75 U7.24
GND  (via drill 0.35)
  Top 0.4: C1.2 10.5,85.7 | R4.1 13,85.7 | C2.2 19.8,85.7 | R6.1 22.3,85.7 | C3.2 arc90 29.4,85.2 29.4,85.7 | R10.1 31.6,85.7 | v124.2,18.1 123.9,17.8
  Top 0.5: C4.2 47.2,84.9 arc-90 47.1,85 47.1,85.1 arc90 46.5,85.7 U4.2 40.8,85.7 | R2.1 4.28,84.88 arc90 4.3,84.9 4.3,85.2 arc-90 4.8,85.7 U1.2 10.5,85.7 13,85.7 U2.2 19.8,85.7 22.3,85.7 U3.2 29.4,85.7 31.6,85.7 U5.2 38.5,85.7 | 38.5,85.7 40.8,85.7 | R8.1 40.9,85.6 arc90 40.8,85.7 | C5.2 38.4,85.6 arc-90 38.5,85.7
  Top 2: J1.3 J1.15 21.3,12.3 arc90 23.3,14.3 23.3,18.7 arc90 21.3,20.7 J1.17 | J1.5 J1.17 | J1.17 J1.18 J1.19 | J1.7 J1.19 | J1.24 22.3,50.1 arc-90 24.3,48.1 24.3,31.1 arc-90 22.3,29.1 J1.19
  Bottom 0.2: U7.5 70.25,30.75 U7.33 | U7.3 70.75,31.75 U7.33 | U7.33 69.75,31.25 U7.21 66.25,31.25 v66.2,31.2 | Y1.2 v78.7,29.5
  Bottom 0.4: R19.1 124.15,18.15 v124.2,18.1
  other vias: 51.8,78.2 52,86 39.5,82.5 30.5,82.5 21.5,82.5 13,83.1 3.7,80.4 11.4,90.1 16.5,90.5 26.5,90.5 35.5,90.5 34.5,14.5 109,7.5 101.5,23.6 92.4,23.5 85,81 96,81
  pour Top: 0,0 160,0 160,100 0,100
  pour Bottom: 0,0 160,0 160,100 0,100
LED0  (via drill 0.35)
  Top 0.4: R11.1 101.5,90.58 arc90 101,90.08 101,45.2 94.7,38.9 v73.3,38.9
  Bottom 0.2: U7.30 70.75,34.55 71.5,35.3 71.5,37.1 v73.3,38.9
LED1  (via drill 0.35)
  Top 0.4: R12.1 102.1,79.58 arc90 101.6,79.08 101.6,44.95 94.95,38.3 73.87,38.3 73.42,37.85 v73.3,37.85
  Bottom 0.2: U7.31 71.25,34.48 71.9,35.14 71.9,36.45 v73.3,37.85
LED2  (via drill 0.35)
  Top 0.4: R13.1 102.7,68.58 arc90 102.2,68.08 102.2,44.7 95.2,37.7 74.32,37.7 73.42,36.8 v73.3,36.8
  Bottom 0.2: U7.32 71.75,34.42 72.3,34.97 72.3,35.8 v73.3,36.8
LED3  (via drill 0.35)
  Top 0.4: R14.1 103.3,57.58 arc90 102.8,57.08 102.8,44.45 95.45,37.1 74.77,37.1 73.42,35.75 v73.3,35.75
  Bottom 0.2: U7.1 72.95,32.75 73.3,33.1 v73.3,35.75
LED4  (via drill 0.35)
  Top 0.4: R15.1 103.9,46.58 arc90 103.4,46.08 103.4,45.4 103.4,44.21 95.69,36.5 75.83,36.5 v74.03,34.7
  Bottom 0.2: v74.03,34.7 73.7,34.38 73.7,32.93 73.09,32.33 72.53,32.33 U7.2
MISO
  Bottom 0.2: U7.16 68.25,27.62 67.93,27.3 63.5,27.3 63,27.8 J25.1
MOSI
  Bottom 0.2: U7.15 68.75,27.55 68.1,26.9 60.1,26.9 59.2,27.8 59.2,30.15 J25.4
N$1
  Top 0.4: D1.C R11.2
N$2
  Top 0.4: D2.C R12.2
N$3
  Bottom 0.4: LCD1.11 102.7,13.2 101.14,14.77 IC1.4
N$4
  Top 0.4: D3.C R13.2
N$5
  Top 0.4: D4.C R14.2
N$6
  Top 0.4: D5.C R15.2
N$7
  Bottom 0.4: LCD1.12 100.16,14.14 99.86,14.44 IC1.5
N$8
  Bottom 0.2: U7.8 74.35,29.25 75.3,28.3 Y1.1
N$9
  Bottom 0.4: LCD1.13 97.62,13.92 98.59,14.89 IC1.6
N$10
  Bottom 0.4: LCD1.14 95.08,12.88 97.33,15.12 IC1.7
N$11
  Bottom 0.2: U7.7 74.35,29.75 75.3,30.7 Y1.3
N$12
  Bottom 0.4: IC1.9 96.06,23.14 98.7,20.5 110.4,20.5 115.4,15.5 LCD1.6
N$13
  Bottom 0.4: IC1.10 97.33,22.77 99,21.1 110.65,21.1 117.94,13.81 LCD1.5
N$14
  Bottom 0.4: IC1.11 98.59,22.35 99.25,21.7 110.9,21.7 120.48,12.12 LCD1.4
N$15
  Bottom 0.4: Q1.1 99.86,30.09 IC1.12
N$16
  Bottom 0.4: LCD1.16 90,30.1 92.2,32.3 Q1.3
N$18
  Bottom 0.4: LCD1.3 123,9.22 R19.2
RST  (via drill 0.35)
  Top 0.2: J25.5 59.85,27.2 67.6,27.2 70.17,29.77 70.17,36.42 v70.25,36.5
  Bottom 0.2: U7.29 v70.25,36.5 70.25,37.23 R16.1
SCK
  Bottom 0.2: U7.17 65.95,29.25 64.8,30.4 61.99,30.4 J25.3
SCL  (via drill 0.35)
  Top 0.2: v102.4,31.8 102.4,33.73 100.53,35.6 79.67,35.6 76.77,32.7 72.63,32.7 71.3,34.03 71.3,37.88 v70.94,38.24
  Bottom 0.2: U7.28 69.75,35.52 68.07,37.2 67.8,37.2 67.6,37.4 67.6,37.8 67.22,38.18 66.9,38.18 | 66.9,38.18 R18.1 | IC1.14 v102.41,31.8 v102.4,31.8 | v70.94,38.24 70.94,39.06 70.4,39.6 68.3,39.6 67.6,38.9 67.6,38.5 67.28,38.18 66.9,38.18
SDA  (via drill 0.35)
  Top 0.2: v103.7,31.8 103.7,33 100.7,36 79.5,36 76.6,33.1 72.79,33.1 71.7,34.19 71.7,38.5 70.9,39.3 65.8,39.3 v65.5,39.6
  Bottom 0.2: U7.27 69.25,35.45 67.9,36.8 65.3,36.8 65.1,37 65.1,37.7 64.62,38.18 R17.1 64.48,38.18 65,38.7 65,39.1 v65.5,39.6 | IC1.15 103.67,31.77 v103.7,31.8

### Text on the board
tPlace: +12V | GND | GND | -12V | +3V3 | GND | +5V | GND | +5V_STDBY | GND